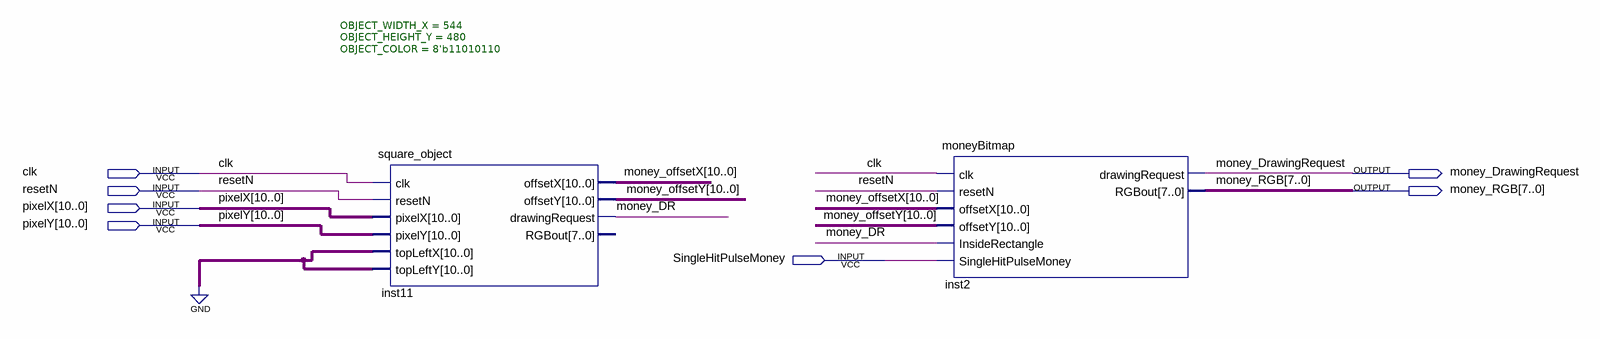
[diagram p0: schematic sheet]
// Quartus schematic MONEY_DISPLAY.bdf as structural Verilog: 2 symbols, 7 pins
module MONEY_DISPLAY (
  input  clk,
  input  resetN,
  input  [10:0] pixelX,
  input  [10:0] pixelY,
  input  SingleHitPulseMoney,
  output money_DrawingRequest,
  output [7:0] money_RGB
);

  wire money_DR;
  wire [10:0] money_offsetX, money_offsetY;

  square_object #(.OBJECT_WIDTH_X(544), .OBJECT_HEIGHT_Y(480), .OBJECT_COLOR(8'b11010110)) inst11 (
    .clk(clk), .resetN(resetN), .pixelX(pixelX), .pixelY(pixelY), .topLeftX({11{1'b0}}),
    .topLeftY({11{1'b0}}), .offsetX(money_offsetX), .offsetY(money_offsetY), .drawingRequest(money_DR));  // open: RGBout
  moneyBitmap inst2 (
    .clk(clk), .resetN(resetN), .offsetX(money_offsetX), .offsetY(money_offsetY), .InsideRectangle(money_DR),
    .SingleHitPulseMoney(SingleHitPulseMoney), .drawingRequest(money_DrawingRequest), .RGBout(money_RGB));
endmodule
